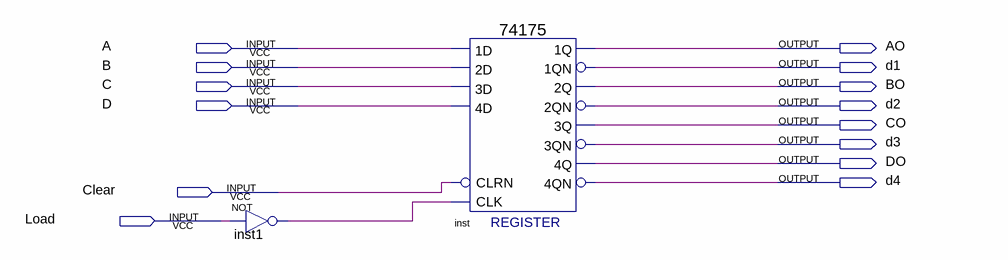
[diagram p0: schematic sheet]
// Quartus schematic PIPO.bdf as structural Verilog: 2 symbols, 14 pins
module PIPO (
  input  A,
  input  B,
  input  C,
  input  D,
  input  Clear,
  input  Load,
  output AO,
  output d1,
  output BO,
  output d2,
  output CO,
  output d3,
  output DO,
  output d4
);

  wire inst1_out;

  not inst1 (inst1_out, Load);
  \74175  inst (
    .CLRN(Clear), .CLK(inst1_out), .\3D (C), .\2D (B), .\1D (A), .\4D (D), .\1QN (d1), .\1Q (AO), .\2QN (d2),
    .\3Q (CO), .\2Q (BO), .\4QN (d4), .\4Q (DO), .\3QN (d3));
endmodule
